# Altium schematic sheet Display.SchDoc
size A4; SheetNumber: 4; SheetTotal: 5
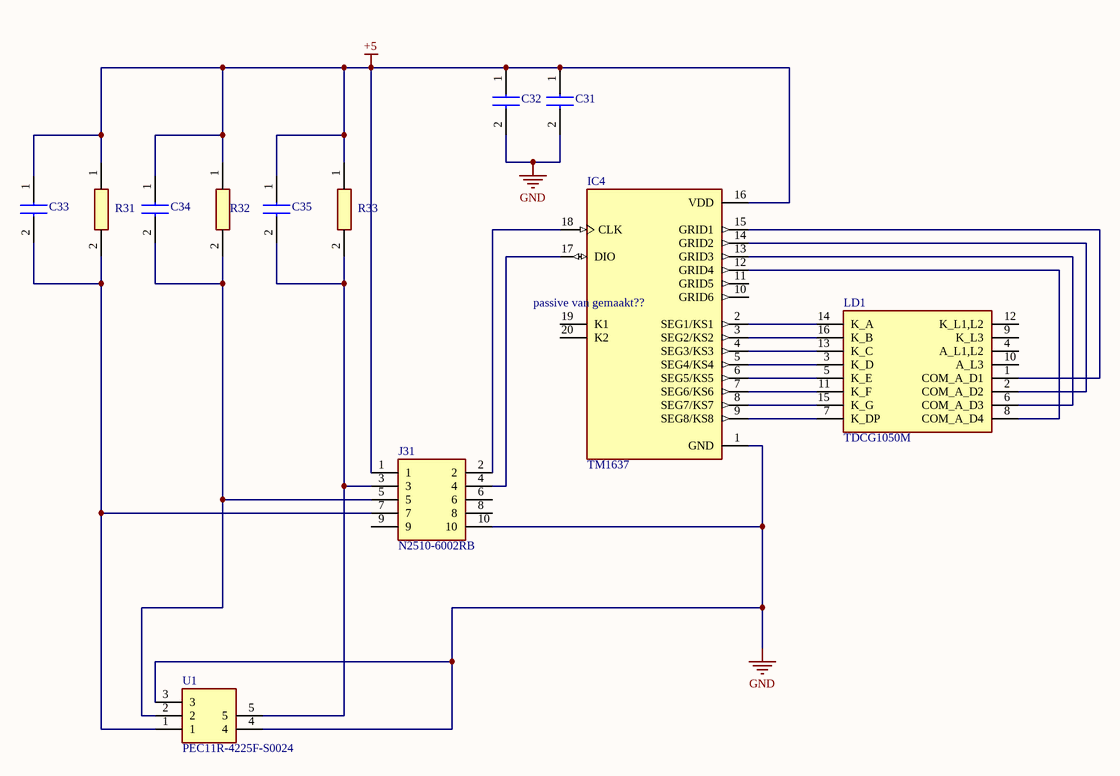
[diagram p0: Display.SchDoc]

## Parts
C31  C0805C104K5RAC7411  [100nF]  (value not drawn)
C32  C0805C104K5RAC7411  [100nF]  (value not drawn)
C33  C0805C103K5TACAUTO  [10nF]  (value not drawn)
C34  C0805C103K5TACAUTO  [10nF]  (value not drawn)
C35  C0805C103K5TACAUTO  [10nF]  (value not drawn)
IC4  TM1637  [DisplayIC]
J31  N2510-6002RB  [SHDR10W64P254_2X5_2002X859X991P]
LD1  TDCG1050M  [Display]
R31  CRCW080510K0DHEAP  [Resistor]  (value not drawn)
R32  CRCW080510K0DHEAP  [Resistor]  (value not drawn)
R33  CRCW080510K0DHEAP  [Resistor]  (value not drawn)
U1  PEC11R-4225F-S0024  [PEC12R-4XXXF-SXXXX_1]

## Nets
+5: C31.1 C32.1 C33.1 C34.1 C35.1 IC4.16(VDD) J31.1 R31.1 R32.1 R33.1
GND: C31.2 C32.2 IC4.1(GND) J31.10 U1.3 U1.4
NetC33_2: C33.2 J31.7 R31.2 U1.1
NetC34_2: C34.2 J31.5 R32.2 U1.2
NetC35_2: C35.2 J31.3 R33.2 U1.5
NetIC4_2: IC4.2(SEG1/KS1) LD1.14(K_A)
NetIC4_3: IC4.3(SEG2/KS2) LD1.16(K_B)
NetIC4_4: IC4.4(SEG3/KS3) LD1.13(K_C)
NetIC4_5: IC4.5(SEG4/KS4) LD1.3(K_D)
NetIC4_6: IC4.6(SEG5/KS5) LD1.5(K_E)
NetIC4_7: IC4.7(SEG6/KS6) LD1.11(K_F)
NetIC4_8: IC4.8(SEG7/KS7) LD1.15(K_G)
NetIC4_9: IC4.9(SEG8/KS8) LD1.7(K_DP)
NetIC4_12: IC4.12(GRID4) LD1.8(COM_A_D4)
NetIC4_13: IC4.13(GRID3) LD1.6(COM_A_D3)
NetIC4_14: IC4.14(GRID2) LD1.2(COM_A_D2)
NetIC4_15: IC4.15(GRID1) LD1.1(COM_A_D1)
NetIC4_17: IC4.17(DIO) J31.4
NetIC4_18: IC4.18(CLK) J31.2

Not connected (* = marked no-connect by the designer): IC4 10(GRID6) 11(GRID5) 19(K1) 20(K2); J31 6 8 9; LD1 4(A_L1,L2) 9(K_L3) 10(A_L3) 12(K_L1,L2)

## Notes on the sheet
- (near IC4) passive van gemaakt??

## Library data of the parts
C31 = C0805C104K5RAC7411: Capacitor  100 uF 50VDC; Manufacturer_Name: Kemet; Datasheet Link: https://componentsearchengine.com//C0805C104K5RAC7411.pdf; Height: 0.88mm; Mouser2 Part Number: 80-C0805C104K5RACLR; Mouser2 Price/Stock: https://www.mouser.com/Search/Refine.aspx?Keyword=80-C0805C104K5RACLR; Manufacturer_Part_Number: C0805C104K5RAC7411
C32 = C0805C104K5RAC7411: Capacitor  0.1 uF 50VDC; Manufacturer_Name: Kemet; Datasheet Link: https://componentsearchengine.com//C0805C104K5RAC7411.pdf; Height: 0.88mm; Mouser2 Part Number: 80-C0805C104K5RACLR; Mouser2 Price/Stock: https://www.mouser.com/Search/Refine.aspx?Keyword=80-C0805C104K5RACLR; Manufacturer_Part_Number: C0805C104K5RAC7411
C33-C35 = C0805C103K5TACAUTO: Capacitor 0.01µF 50VDC; Manufacturer_Name: Kemet; Height: 0.88mm; Manufacturer_Part_Number: C0805C103K5TACAUTO
IC4 = TM1637: LED Drive Control Special Circuit; MF: Titan Micro Electronics; Package: Package; Availability: Not in stock; SnapEDA_Link: https://www.snapeda.com/parts/TM1637/Titan+Micro+Electronics/view-part/?ref=snap; MP: TM1637; Check_prices: https://www.snapeda.com/parts/TM1637/Titan+Micro+Electronics/view-part/?ref=eda; Value: *; Price: None
J31 = N2510-6002RB: Connector; Manufacturer_Name: 3M; Datasheet Link: https://componentsearchengine.com//N2510-6002RB.pdf; Height: 9.91mm; Mouser2 Part Number: 517-N2510-6002RB; Mouser2 Price/Stock: https://www.mouser.com/Search/Refine.aspx?Keyword=517-N2510-6002RB; Manufacturer_Part_Number: N2510-6002RB
LD1 = TDCG1050M: Display; Manufacturer_Name: Vishay; Datasheet Link: https://componentsearchengine.com//TDCG1050M.pdf; Height: 7.25mm; Mouser2 Part Number: 78-TDCG1050; Mouser2 Price/Stock: https://www.mouser.com/Search/Refine.aspx?Keyword=78-TDCG1050; Manufacturer_Part_Number: TDCG1050M
R31-R33 = CRCW080510K0DHEAP: Resistor 10KOhm; Manufacturer_Name: Vishay; Datasheet Link: https://www.arrow.com/en/products/crcw080510k0dheap/vishay; Height: 0.5mm; Manufacturer_Part_Number: CRCW080510K0DHEAP
U1 = PEC11R-4225F-S0024: Undefined or Miscellaneous; Manufacturer_Name: Bourns; Datasheet Link: https://componentsearchengine.com//PEC11R-4225F-S0024.pdf; Mouser2 Part Number: 652-PEC11R-4225F-S24; Mouser2 Price/Stock: https://www.mouser.com/Search/Refine.aspx?Keyword=652-PEC11R-4225F-S24; Manufacturer_Part_Number: PEC11R-4225F-S0024